# EAGLE design mimic1567 (EAGLE 7.5.0)
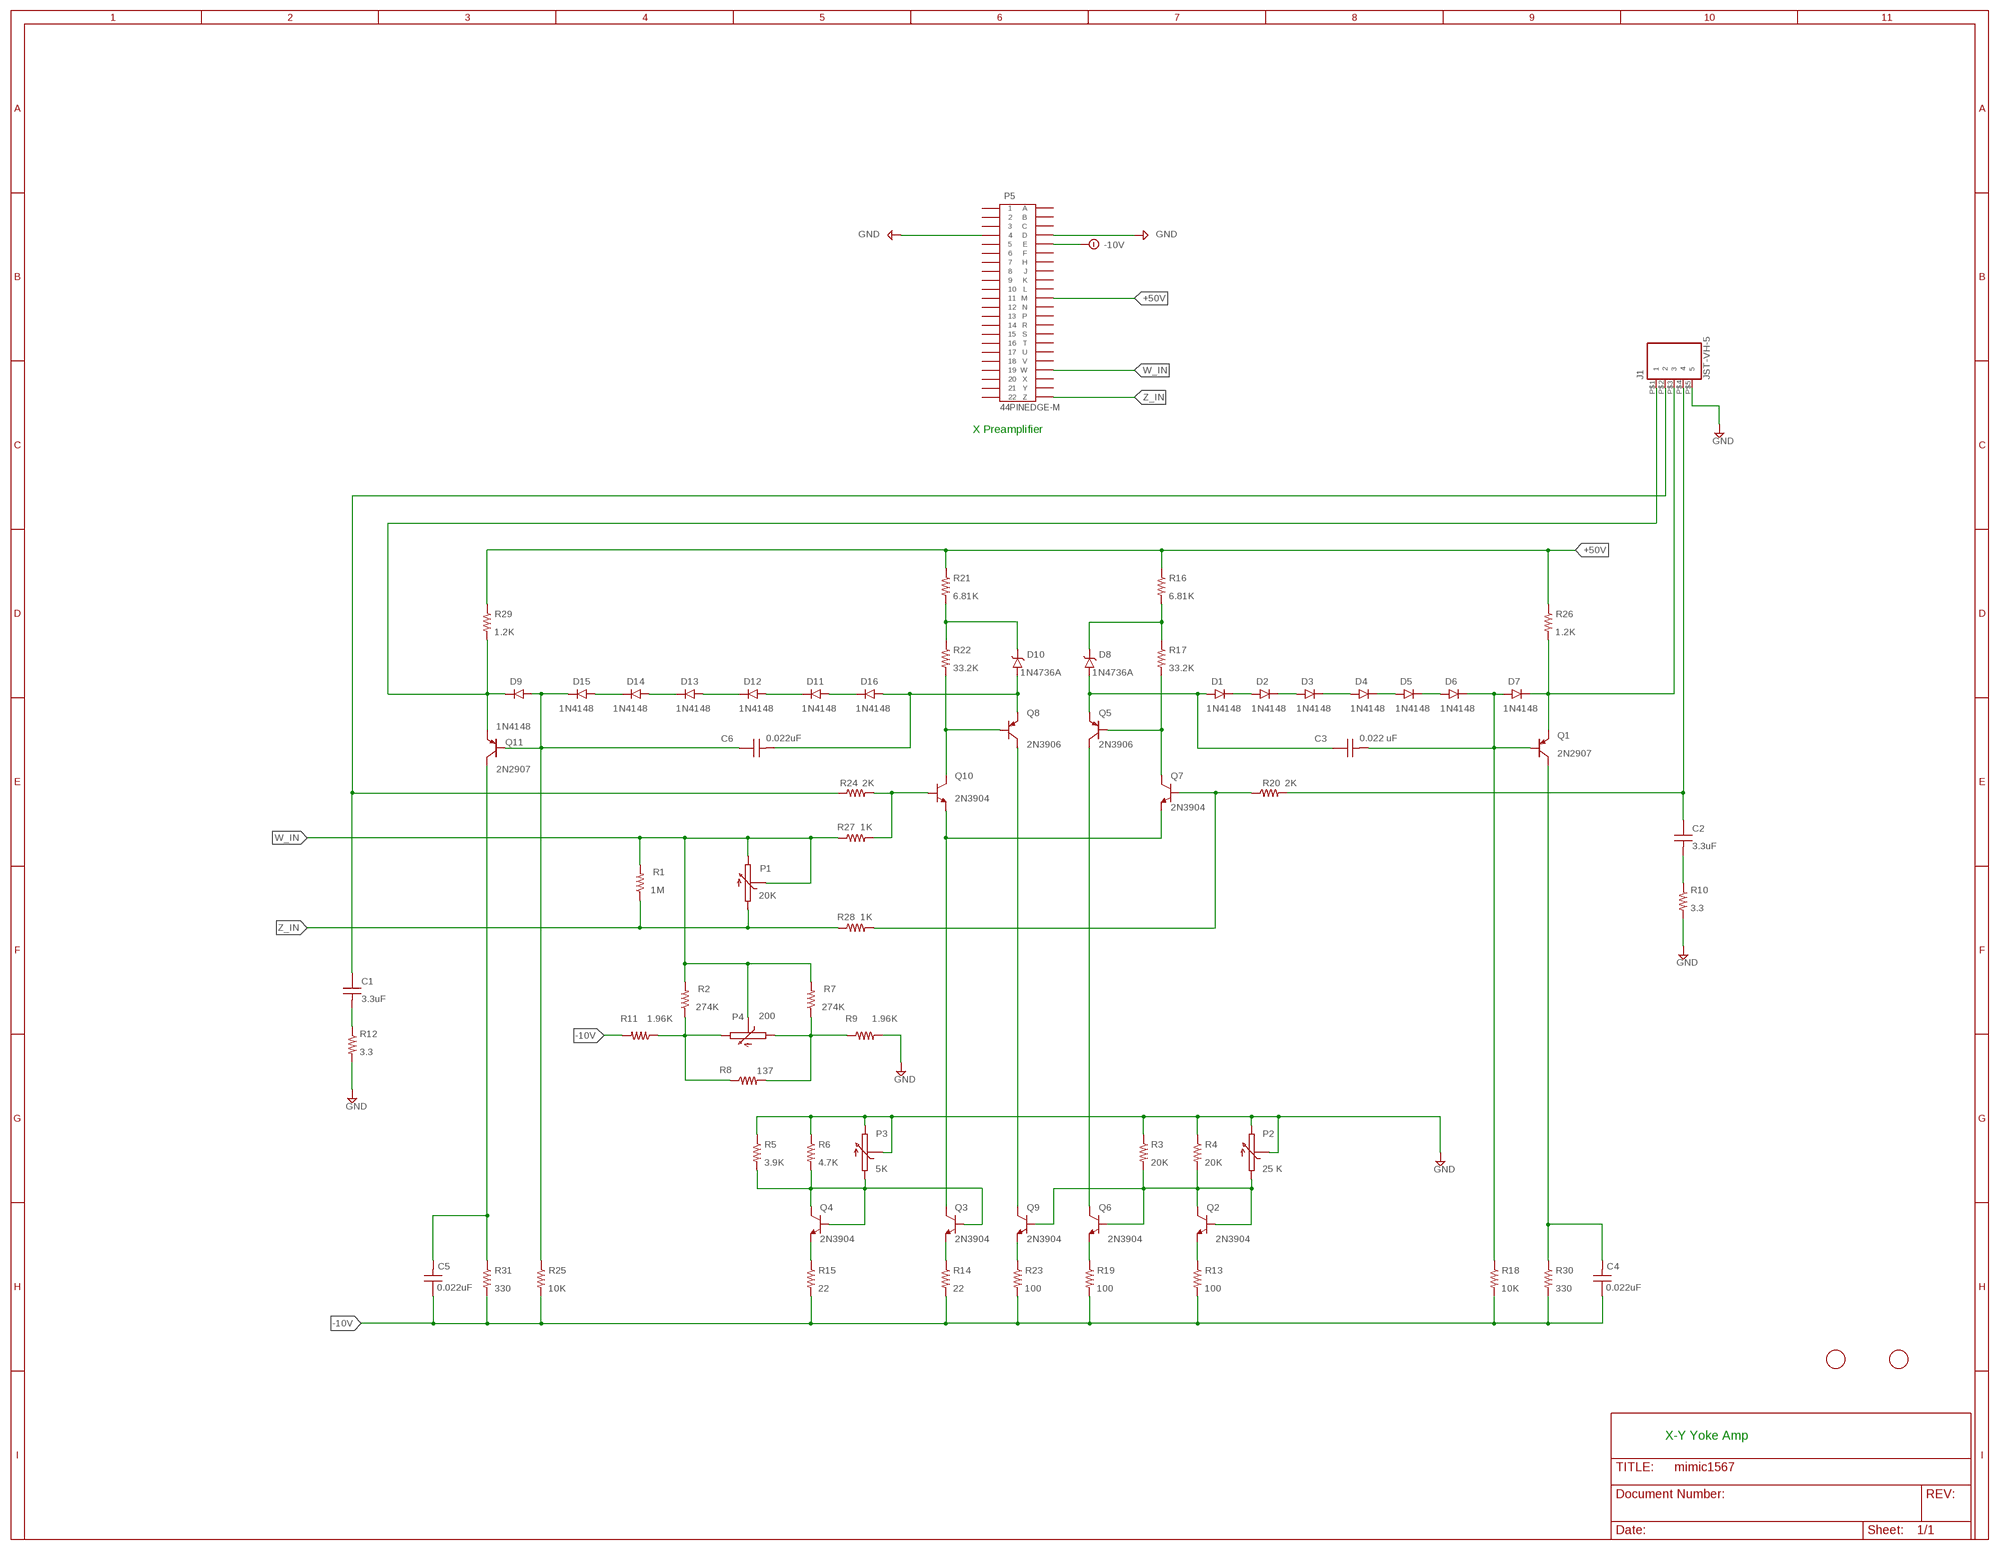
[diagram p0: schematic, sheet 1]

## Parts
C1  3.3uF  ECQ-E2335JF  [CAP-3-PT-ZERO-3UF-250V-FILM]
C2  3.3uF  ECQ-E2335JF  [CAP-3-PT-ZERO-3UF-250V-FILM]
C3  0.022 uF  ECQ-E2223JF  [CAP-ZERO-PT-ZERO-22UF-250V-FILM]
C4  0.022uF  ECQ-E2223JF  [CAP-ZERO-PT-ZERO-22UF-250V-FILM]
C5  0.022uF  ECQ-E2223JF  [CAP-ZERO-PT-ZERO-22UF-250V-FILM]
C6  0.022uF  ECQ-E2223JF  [CAP-ZERO-PT-ZERO-22UF-250V-FILM]
D1  1N4148  [DO35-7]
D2  1N4148  [DO35-7]
D3  1N4148  [DO35-7]
D4  1N4148  [DO35-7]
D5  1N4148  [DO35-7]
D6  1N4148  [DO35-7]
D7  1N4148  [DO35-7]
D8  1N4736A  [DO41]
D9  1N4148  [DO35-7]
D10  1N4736A  [DO41]
D11  1N4148  [DO35-7]
D12  1N4148  [DO35-7]
D13  1N4148  [DO35-7]
D14  1N4148  [DO35-7]
D15  1N4148  [DO35-7]
D16  1N4148  [DO35-7]
J1  JST-VH-5  [VHR-5N]
P1  20K  POT-3006P  [3006P]
P2  25 K  POT-3006P  [3006P]
P3  5K  POT-3006P  [3006P]
P4  200  POT-3006P  [3006P]
P5  44PINEDGE-M  [44PINEDGE]
Q1  2N2907  [TO18]
Q2  2N3904  [TO92]
Q3  2N3904  [TO92]
Q4  2N3904  [TO92]
Q5  2N3906  [TO92]
Q6  2N3904  [TO92]
Q7  2N3904  [TO92]
Q8  2N3906  [TO92]
Q9  2N3904  [TO92]
Q10  2N3904  [TO92]
Q11  2N2907  [TO18]
R1  1M  AXIALRESISTORQUARTER_WATT  [R_QUARTERWATT]
R2  274K  AXIALRESISTORQUARTER_WATT  [R_QUARTERWATT]
R3  20K  AXIALRESISTORQUARTER_WATT  [R_QUARTERWATT]
R4  20K  AXIALRESISTORQUARTER_WATT  [R_QUARTERWATT]
R5  3.9K  AXIALRESISTORQUARTER_WATT  [R_QUARTERWATT]
R6  4.7K  AXIALRESISTORQUARTER_WATT  [R_QUARTERWATT]
R7  274K  AXIALRESISTORQUARTER_WATT  [R_QUARTERWATT]
R8  137  AXIALRESISTORQUARTER_WATT  [R_QUARTERWATT]
R9  1.96K  AXIALRESISTORQUARTER_WATT  [R_QUARTERWATT]
R10  3.3  R-1/2WATT  [0309/12]
R11  1.96K  AXIALRESISTORQUARTER_WATT  [R_QUARTERWATT]
R12  3.3  R-1/2WATT  [0309/12]
R13  100  AXIALRESISTORQUARTER_WATT  [R_QUARTERWATT]
R14  22  AXIALRESISTORQUARTER_WATT  [R_QUARTERWATT]
R15  22  AXIALRESISTORQUARTER_WATT  [R_QUARTERWATT]
R16  6.81K  AXIALRESISTORHALF_WATT  [R_HALFWATT]
R17  33.2K  AXIALRESISTORHALF_WATT  [R_HALFWATT]
R18  10K  AXIALRESISTORHALF_WATT  [R_HALFWATT]
R19  100  AXIALRESISTORQUARTER_WATT  [R_QUARTERWATT]
R20  2K  AXIALRESISTORQUARTER_WATT  [R_QUARTERWATT]
R21  6.81K  AXIALRESISTORHALF_WATT  [R_HALFWATT]
R22  33.2K  AXIALRESISTORHALF_WATT  [R_HALFWATT]
R23  100  AXIALRESISTORQUARTER_WATT  [R_QUARTERWATT]
R24  2K  AXIALRESISTORQUARTER_WATT  [R_QUARTERWATT]
R25  10K  AXIALRESISTORHALF_WATT  [R_HALFWATT]
R26  1.2K  R-5WATT  [R_FIVEWATT]
R27  1K  AXIALRESISTORQUARTER_WATT  [R_QUARTERWATT]
R28  1K  AXIALRESISTORQUARTER_WATT  [R_QUARTERWATT]
R29  1.2K  R-5WATT  [R_FIVEWATT]
R30  330  AXIALRESISTORONE_WATT  [R_ONEWATT]
R31  330  AXIALRESISTORONE_WATT  [R_ONEWATT]
U$1  FIDUCIAL  [FIDUCIAL_1MM]
U$2  FIDUCIAL  [FIDUCIAL_1MM]

## Nets
+50V: P5.M R16.1 R21.1 R26.1 R29.1
-10V: C4.1 C5.1 P5.E R11.2 R13.2 R14.2 R15.2 R18.2 R19.2 R23.2 R25.2 R30.2 R31.2
GND: J1.P$5 P2.2 P2.3 P3.2 P3.3 P5.4 P5.D R3.1 R4.1 R5.1 R6.1 R9.2 R10.2 R12.2
N$1: Q4.1(E) R15.1
N$2: C2.1 J1.P$4 R20.2
N$3: C2.2 R10.1
N$4: P2.1 Q2.2(B) Q2.3(C) Q6.2(B) Q9.2(B) R3.2 R4.2
N$5: D7.C J1.P$3 Q1.1(E) R26.2
N$6: Q7.2(B) R20.1 R28.2
N$7: C3.2 D6.C D7.A Q1.2(B) R18.1
N$8: C4.2 Q1.3(C) R30.1
N$9: Q8.1(C) Q9.3(C)
N$10: D5.C D6.A
N$11: D4.C D5.A
N$12: D3.C D4.A
N$13: D2.C D3.A
N$14: D1.C D2.A
N$15: C3.1 D1.A D8.A Q5.3(E)
N$16: Q5.2(B) Q7.3(C) R17.2
N$17: D8.C R16.2 R17.1
N$18: Q3.1(E) R14.1
N$19: Q3.3(C) Q7.1(E) Q10.1(E)
N$20: D10.C R21.2 R22.1
N$21: Q5.1(C) Q6.3(C)
N$22: P4.1 R7.1 R8.2 R9.1
N$23: Q9.1(E) R23.1
N$24: Q6.1(E) R19.1
N$25: Q8.2(B) Q10.3(C) R22.2
N$26: Q2.1(E) R13.1
N$27: C1.1 J1.P$2 R24.1
N$29: P3.1 Q3.2(B) Q4.2(B) Q4.3(C) R5.2 R6.2
N$30: C1.2 R12.1
N$31: D9.C J1.P$1 Q11.1(E) R29.2
N$33: C6.1 D9.A D15.C Q11.2(B) R25.1
N$34: C5.2 Q11.3(C) R31.1
N$35: D14.C D15.A
N$36: D13.C D14.A
N$37: D12.C D13.A
N$38: D11.C D12.A
N$39: D11.A D16.C
N$40: C6.2 D10.A D16.A Q8.3(E)
N$43: Q10.2(B) R24.2 R27.2
N$44: P4.3 R2.1 R8.1 R11.1
W_IN: P1.2 P1.3 P4.2 P5.W R1.2 R2.2 R7.2 R27.1
Z_IN: P1.1 P5.Z R1.1 R28.1
Unconnected: P5.1 P5.2 P5.3 P5.5 P5.6 P5.7 P5.8 P5.9 P5.10 P5.11 P5.12 P5.13 P5.14 P5.15 P5.16 P5.17 P5.18 P5.19 P5.20 P5.21 P5.22 P5.A P5.B P5.C P5.F P5.H P5.J P5.K P5.L P5.N P5.P P5.R P5.S P5.T P5.U P5.V P5.X P5.Y

## Notes on the sheet
- X Preamplifier
- X-Y Yoke Amp

## Library data of the parts
C1 C2 = keiths:ECQ-E2335JF: FILM CAPACITOR, 3.3UF, 250V, 5%, RADIAL Capacitor Dielectric Type:PET (Polyester) Metallized Polyester Film Capacitor; PN: ECQ-E2335JF
C3-C6 = keiths:ECQ-E2223JF: FILM CAPACITOR, 0.022UF, 250V, 5%, RADIAL Capacitor Dielectric Type:PET (Polyester) Lead Spacing:10mm; PN: ECQ-E2223JFB
D1-D7 D9 D11-D16 = keiths:1N4148: High Conductance Fast Diode; PN: 1N4148
D8 D10 = keiths:1N4736A: Z DIODE 6.8 V, 1W, 5 percent; PN: 1N4736A
J1 = keiths:JST-VH-5: JST CONN HEADER VH SIDE 5POS 3.96MM
P1 = keiths:POT-3006P: 3006 - Trimpot® Trimming Potentiometer. Clockwise turn moves wiper to pin 3; PN: 3006P-1-203LF
P2 = keiths:POT-3006P: 3006 - Trimpot® Trimming Potentiometer. Clockwise turn moves wiper to pin 3; PN: 3006P-1-253LF
P3 = keiths:POT-3006P: 3006 - Trimpot® Trimming Potentiometer. Clockwise turn moves wiper to pin 3; PN: 3006P-1-103LF
P4 = keiths:POT-3006P: 3006 - Trimpot® Trimming Potentiometer. Clockwise turn moves wiper to pin 3; PN: 3006P-1-201LF
P5 = keiths:44PINEDGE-M: 44 PIN EDGE CONNECTOR FOR PCB
Q1 Q11 = keiths:2N2907: The 2N2907 is a commonly available PNP bipolar junction transistor used for general purpose low-power amplifying or switching applications. It is designed for low to medium current, low power, medium voltage, and can operate at moderately high speeds.; PN: 2N2907A
Q2-Q4 Q6 Q7 Q9 Q10 = keiths:2N3904: NPN Transistor; PN: 2N3904
Q5 Q8 = keiths:2N3906: PNP Transistor; PN: 2N3906
R1 R2 R7 = keiths:AXIALRESISTOR: Through hole axial leaded resistors.; PN: MFR-25FBF52-274K
R3 R5 R13-R15 R19 R23 = keiths:AXIALRESISTOR: Through hole axial leaded resistors.; PN: RNF14FTD2K94
R4 R6 = keiths:AXIALRESISTOR: Through hole axial leaded resistors.; PN: RNF14FTD4K64
R8 = keiths:AXIALRESISTOR: Through hole axial leaded resistors.; PN: CMF55137R00FHEB
R9 R11 = keiths:AXIALRESISTOR: Through hole axial leaded resistors.; PN: RNF14FTD1K96
R10 R12 = keiths:R-1/2WATT: Half watt through hole resistor.
R16 R21 = keiths:AXIALRESISTOR: Through hole axial leaded resistors.; PN: MFS1/2DCT52R6811F
R17 R22 = keiths:AXIALRESISTOR: Through hole axial leaded resistors.; PN: SFR16S0003322FR500
R18 R25 = keiths:AXIALRESISTOR: Through hole axial leaded resistors.; PN: MF1/2LCT52R103J
R20 R24 = keiths:AXIALRESISTOR: Through hole axial leaded resistors.; PN: MFR-25FRF52-2K
R26 R29 = keiths:R-5WATT: Cemented Leaded Wirewound Resistors; PN: AC05000001201JAC00
R27 R28 = keiths:AXIALRESISTOR: Through hole axial leaded resistors.; PN: MFR-25FRF52-1K
R30 R31 = keiths:AXIALRESISTOR: Through hole axial leaded resistors.; PN: SFR16S0003300JA500
U$1 U$2 = adafruit:FIDUCIAL: For use by pick and place machines to calibrate the vision/machine, 1mm By microbuilder.eu

## Board
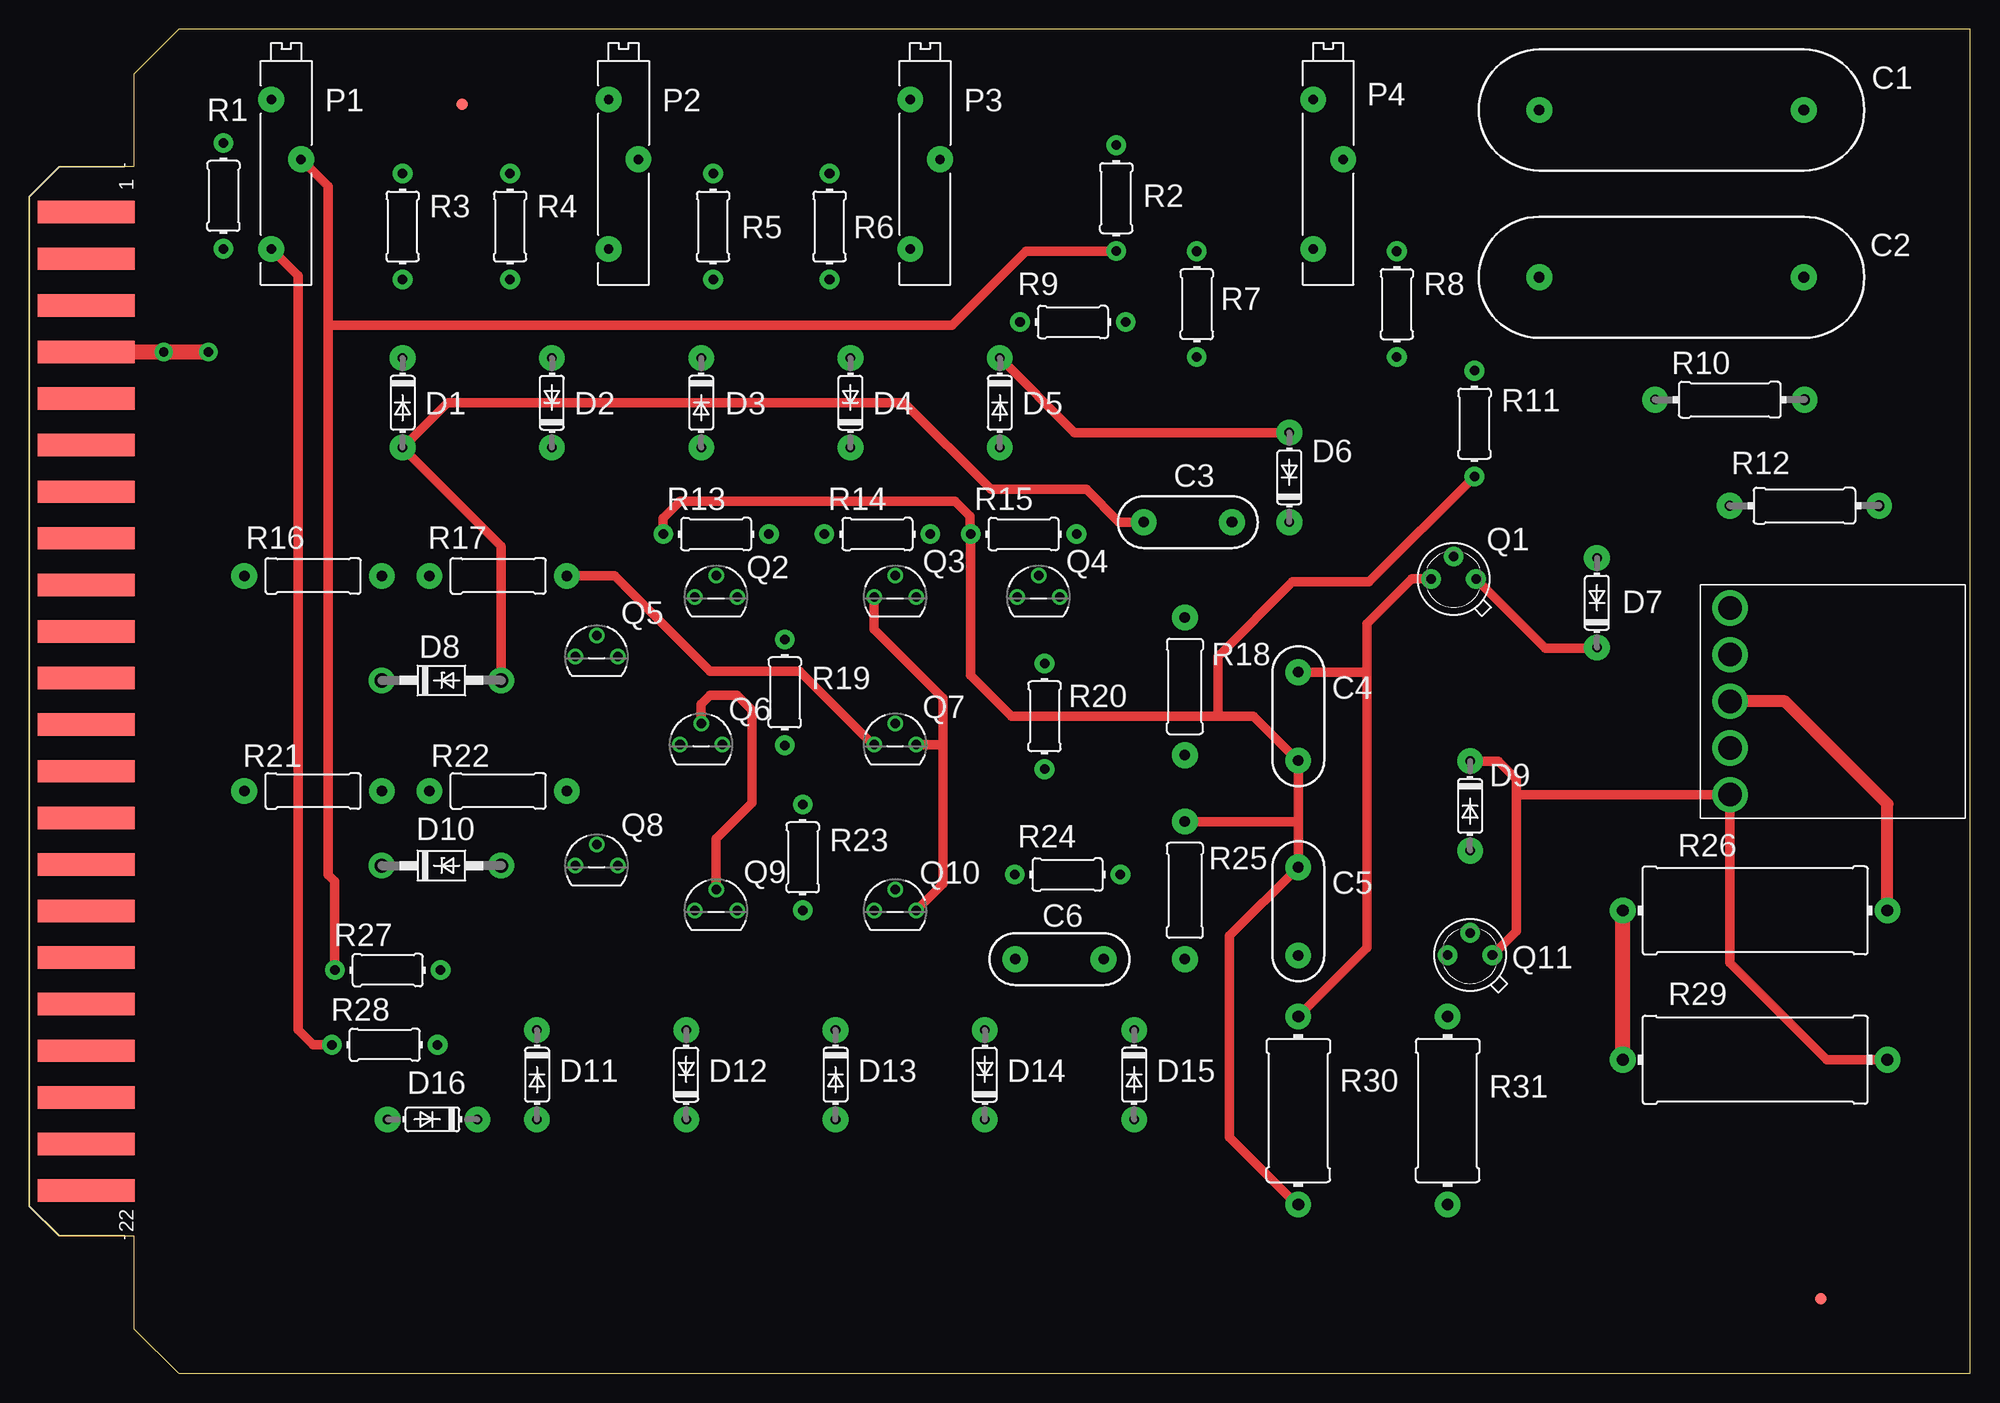
[diagram p1: board, top side]
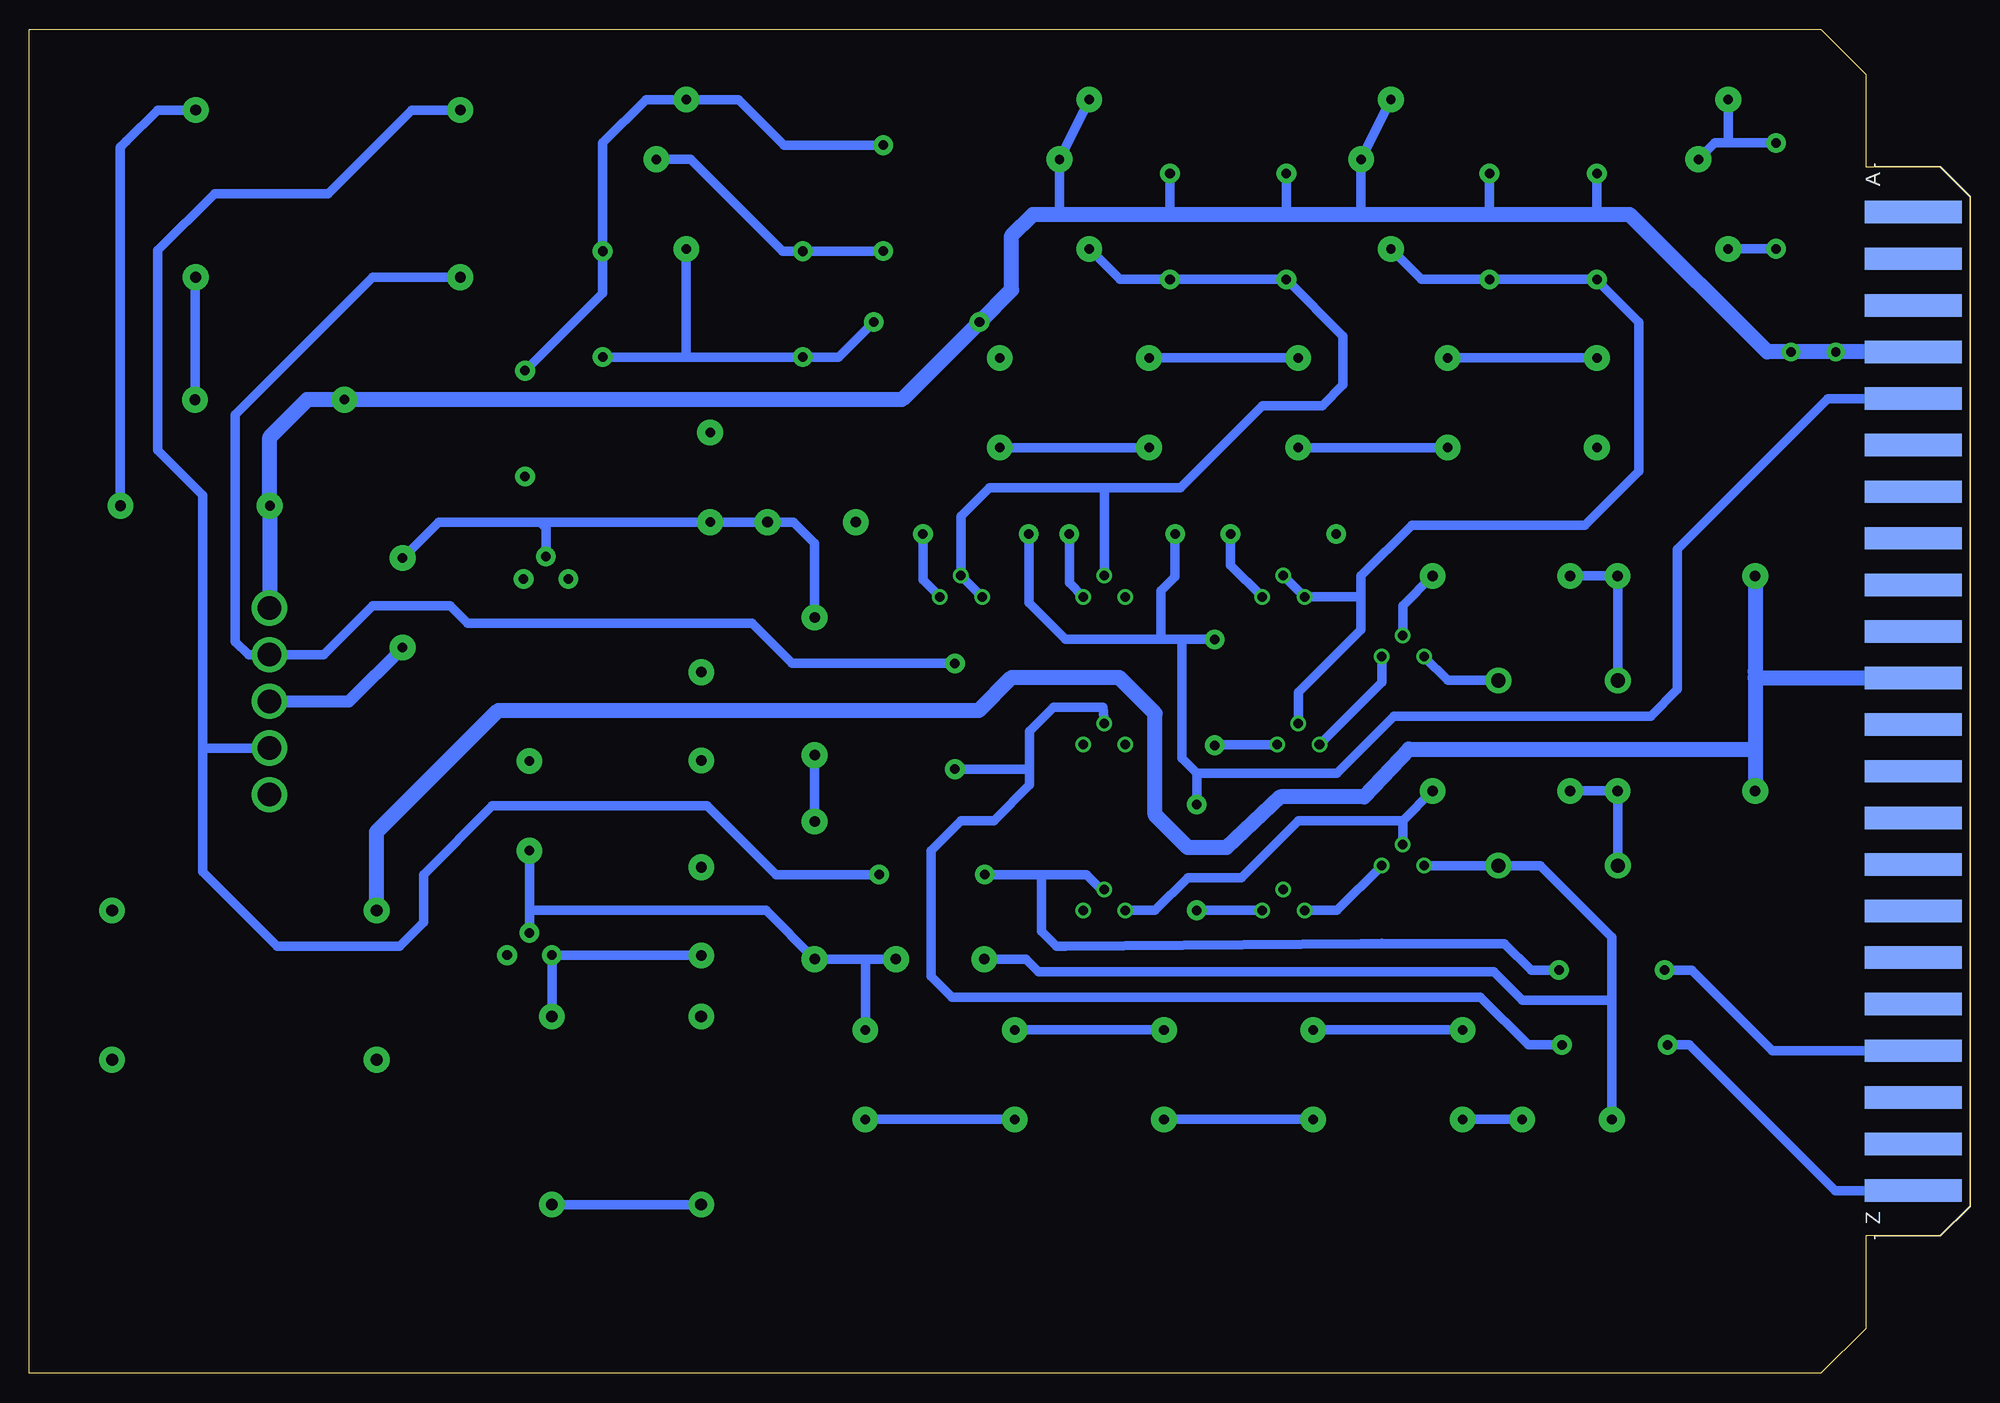
[diagram p2: board, bottom side, seen from below]

Size 165.1 x 114.3 mm. Coordinates in mm from the lower left corner, seen from the top.
Outline: 2.54,11.68 8.89,11.68 8.89,3.81 12.7,0 165.1,0 165.1,114.3 12.7,114.3 8.89,110.49 8.89,102.62 2.54,102.62 0,100.08 0,14.22 2.54,11.68
Copper layers (1*16): Top 0.035mm / dielectric 1.5mm / Bottom 0.035mm
Design rules "throughhole *": minimum track width 32mil, minimum drill 26mil, track to track 30mil, track to pad 30mil, pad to pad 30mil, via to via 30mil, smd to smd 30mil, copper to edge 20mil, drill to drill 20mil, minimum pad ring 10mil, minimum via ring 15mil, stop-mask expansion 4mil, vias tented up to drill 0mil, thermal gap 10mil

### Footprints (pad centres in the part's own frame; a part is rotated, then mirrored left to right if it is on the bottom)
CAP-3-PT-ZERO-3UF-250V-FILM = drill 0.9 pad 2.184: 1 -11.25,0; 2 11.25,0
CAP-ZERO-PT-ZERO-22UF-250V-FILM = drill 0.9 pad 2.184: 1 -3.75,0; 2 3.75,0
DO35-7 = drill 0.813 pad 2.184: A 3.81,0; C -3.81,0
DO41 = drill 1.2 pad 2.184: A 5.08,0; C -5.08,0
VHR-5N = drill 2: P$1 -9,-7.938; P$2 -9,-3.969; P$3 -9,0; P$4 -9,3.969; P$5 -9,7.938
3006P = drill 0.8 pad 2.184: 1 -6.477,1.27; 2 1.143,-1.27; 3 6.223,1.27
44PINEDGE = smd 1.905 x 8.255: 1 -41.605,4.826; 2 -37.643,4.826; 3 -33.68,4.826; 4 -29.718,4.826; 5 -25.756,4.826; 6 -21.793,4.826; 7 -17.831,4.826; 8 -13.868,4.826; 9 -9.906,4.826; 10 -5.944,4.826; 11 -1.981,4.826; 12 1.981,4.826; 13 5.944,4.826; 14 9.906,4.826; 15 13.868,4.826; 16 17.831,4.826; 17 21.793,4.826; 18 25.756,4.826; 19 29.718,4.826; 20 33.68,4.826; 21 37.643,4.826; 22 41.605,4.826 | smd 1.905 x 8.255 bottom: A -41.605,4.826; B -37.643,4.826; C -33.68,4.826; D -29.718,4.826; E -25.756,4.826; F -21.793,4.826; H -17.831,4.826; J -13.868,4.826; K -9.906,4.826; L -5.944,4.826; M -1.981,4.826; N 1.981,4.826; P 5.944,4.826; R 9.906,4.826; S 13.868,4.826; T 17.831,4.826; U 21.793,4.826; V 25.756,4.826; W 29.718,4.826; X 33.68,4.826; Y 37.643,4.826; Z 41.605,4.826
TO18 = drill 0.813 pad 1.676: 1 1.905,0; 2 0,1.905; 3 -1.905,0
TO92 = drill 0.813: 1 1.27,-1.27; 2 1.27,1.27; 3 -1.27,1.27
R_QUARTERWATT = drill 0.813 pad 1.676: 1 -4.5,0; 2 4.5,0
0309/12 = drill 0.9 pad 2.184: 1 -6.35,0 | drill 0.813 pad 2.184: 2 6.35,0
R_HALFWATT = drill 0.9 pad 2.184: 1 -5.85,0; 2 5.85,0
R_FIVEWATT = drill 1 pad 2.184: 1 -11.25,0; 2 11.25,0
R_ONEWATT = drill 1 pad 2.184: 1 -8,0; 2 8,0
FIDUCIAL_1MM = smd 1 x 1: 1 0,0

### Placement (x,y rotation side)
C1  139.7,107.44 0 top
C2  139.7,93.22 0 top
C3  98.55,72.39 0 top
C4  107.95,55.88 90 top
C5  107.95,39.29 270 top
C6  87.63,35.22 180 top
D1  31.75,82.55 270 top
D2  44.45,82.55 90 top
D3  57.15,82.55 270 top
D4  69.85,82.55 90 top
D5  82.55,82.55 270 top
D6  107.19,76.2 90 top
D7  133.35,65.53 90 top
D8  35.05,58.93 0 top
D9  122.56,48.26 270 top
D10  35.05,43.18 0 top
D11  43.18,25.4 270 top
D12  55.88,25.4 90 top
D13  68.58,25.4 270 top
D14  81.28,25.4 90 top
D15  93.98,25.4 270 top
D16  34.29,21.59 180 top
J1  153.67,57.15 0 top
P1  21.84,102.11 90 top
P2  50.55,102.11 90 top
P3  76.2,102.11 90 top
P4  110.49,102.11 90 top
P5  0,57.15 270 top
Q1  121.16,67.56 0 top
Q2  58.42,66.04 45 top
Q3  73.66,66.04 45 top
Q4  85.85,66.04 45 top
Q5  48.26,60.96 45 top
Q6  57.15,53.47 45 top
Q7  73.66,53.47 45 top
Q8  48.26,43.18 45 top
Q9  58.42,39.37 45 top
Q10  73.66,39.37 45 top
Q11  122.56,35.56 0 top
R1  16.51,100.14 90 top
R2  92.46,99.95 270 top
R3  31.75,97.54 270 top
R4  40.89,97.54 270 top
R5  58.17,97.54 270 top
R6  68.07,97.54 270 top
R7  99.31,90.93 90 top
R8  116.33,90.93 270 top
R9  88.77,89.41 180 top
R10  144.65,82.8 180 top
R11  122.94,80.77 270 top
R12  151,73.79 180 top
R13  58.42,71.37 180 top
R14  72.14,71.37 180 top
R15  84.58,71.37 180 top
R16  24.13,67.82 0 top
R17  39.88,67.82 0 top
R18  98.3,58.42 270 top
R19  64.26,57.91 90 top
R20  86.36,55.88 90 top
R21  24.13,49.53 0 top
R22  39.88,49.53 0 top
R23  65.79,43.88 90 top
R24  88.32,42.42 180 top
R25  98.3,41.07 90 top
R26  146.81,39.37 0 top
R27  30.48,34.29 0 top
R28  30.23,27.94 0 top
R29  146.81,26.67 0 top
R30  107.95,22.35 270 top
R31  120.65,22.35 270 top
U$1  36.83,107.95 0 top
U$2  152.4,6.35 0 top

### Tracks (layer width: path | path; a pad name or v marks a point on that pad's centre or on a via)
+50V
  Top 1.27: R29.1 R26.1
  Bottom 0.813: 18.53,53.09 18.28,52.83 | 18.28,59.13 18.28,59.69
  Bottom 1.016: 18.28,59.69 18.28,59.18 18.23,59.13
  Bottom 1.27: R16.1 18.28,59.69 | 18.28,59.18 18.28,52.83 R21.1 | 18.53,53.09 47.75,53.09 51.56,49.02 58.67,49.02 63.25,44.7 66.55,44.7 69.34,47.5 69.34,56.13 72.39,59.18 81.53,59.18 84.33,56.39 125.22,56.39 135.56,46.05 R26.1 | P5.M 18.28,59.13
-10V
  Top 0.813: R30.2 107.82,14.35 102.11,20.07 102.11,37.2 C5.1 107.95,46.92 | 107.95,46.92 C4.1 107.89,52.13 104.14,55.88 101.09,55.88 | R25.2 107.95,46.92 | R13.2 53.92,72.72 55.37,74.17 78.74,74.17 80.01,72.9 80.01,71.45 R15.2 80.08,59.36 83.57,55.88 101.09,55.88 | 101.09,55.88 101.09,60.96 107.44,67.31 113.97,67.31 R11.2
  Bottom 0.813: R31.2 R30.2 | R18.2 R25.2 | R15.2 80.08,65.53 76.96,62.41 68.83,62.41 68.83,62.48 | 65.79,51.05 53.85,51.05 49.02,55.88 27.18,55.88 24.89,58.17 24.89,70.1 12.09,82.91 P5.E | R14.2 67.64,67.75 68.83,66.55 68.83,62.48 | R23.2 65.79,51.05 | R19.2 67.06,62.41 | 67.06,62.41 68.76,62.41 68.83,62.48 | 65.79,51.05 67.06,52.32 67.06,62.41
GND  (via drill 0.8)
  Top 1.27: P5.4 v11.43,86.87 v15.24,86.87
  Bottom 0.813: R3.1 31.75,98.55 | R4.1 40.89,98.55 | 51.82,98.55 P2.2 P2.3 | R5.1 58.17,98.55 | R6.1 68.07,98.55 | 77.47,98.55 P3.2 P3.3 | R10.2 96.01,82.8 | R12.2 144.67,73.77
  Bottom 1.27: 144.67,73.77 J1.P$5 | R12.2 144.65,79.63 141.48,82.8 R10.2 90.88,82.8 R9.2 81.53,92.15 81.53,96.77 79.76,98.55 77.47,98.55 68.07,98.55 58.17,98.55 51.82,98.55 40.89,98.55 31.75,98.55 28.96,98.55 17.27,86.87 v15.24,86.87 v11.43,86.87 P5.4
N$1
  Bottom 0.813: R15.1 89.08,69.6 89.08,68.74 89.08,67.47 Q4.1
N$2
  Bottom 0.813: R20.2 100.22,60.38 103.63,63.79 127.8,63.79 129.29,65.28 135.89,65.28 140.05,61.12 J1.P$4 146.46,61.12 147.57,62.23 147.57,81.53 135.89,93.22 C2.1
N$3
  Bottom 0.813: R10.1 151,93.17 C2.2
N$4
  Top 0.813: Q9.2 58.42,45.47 61.47,48.51 61.47,56.39 60.2,57.66 57.91,57.66 57.15,56.9 Q6.2
  Bottom 0.813: P2.1 46.68,93.04 R4.2 R3.2 31.75,92.96 28.19,89.41 28.19,76.71 32.77,72.14 47.5,72.14 51.82,67.82 51.82,66.04 | Q2.2 Q2.3 51.82,66.04 | Q6.2 57.15,57.91 51.82,63.25 51.82,66.04
N$5
  Top 0.813: Q1.1 128.97,61.66 133.29,61.66 D7.C
  Top 1.016: R26.2 158.06,48.44 149.35,57.15 J1.P$3
  Bottom 1.016: J1.P$3 137.92,57.15 D7.C
N$6
  Bottom 0.813: Q7.2 73.77,56.64 77.98,56.64 80.01,54.61 80.01,51.56 | R20.1 80.19,51.38 80.01,51.56 | 80.01,51.56 80.01,50.04 83.06,46.99 85.85,46.99 88.39,44.45 88.39,33.78 86.61,32 41.66,32 37.59,27.94 R28.2
N$7
  Bottom 0.813: D7.A 130.3,72.39 121.67,72.39 | 121.67,72.39 D6.C C3.2 100.08,72.39 98.3,70.61 R18.1 | Q1.2 121.16,71.88 121.67,72.39
N$8
  Top 0.813: R30.1 113.79,36.19 113.79,59.63 | 113.79,59.63 113.79,63.75 117.6,67.56 Q1.3 | C4.2 113.79,59.63
N$9
  Bottom 0.813: Q8.1 53.87,39.37 Q9.3
N$10
  Top 0.813: D6.A 88.9,80.01 D5.C
N$11
  Bottom 0.813: D5.A D4.C
N$12
  Bottom 0.813: D3.C D4.A
N$13
  Bottom 0.813: D2.C D3.A
N$14
  Bottom 0.813: D1.C D2.A
N$15
  Top 0.813: C3.1 92.71,72.39 89.92,75.18 81.79,75.18 74.42,82.55 35.56,82.55 D1.A 40.13,70.36 D8.A
  Bottom 0.813: D8.A 44.43,58.93 Q5.3
N$16
  Top 0.813: Q7.3 71.75,53.47 65.53,59.69 57.91,59.69 49.78,67.82 R17.2
  Bottom 0.813: Q5.2 48.26,65.29 R17.2
N$17
  Bottom 0.813: R17.1 R16.2 D8.C
N$18
  Bottom 0.813: R14.1 76.64,67.22 Q3.1
N$19
  Top 0.813: 77.72,53.59 77.72,41.64 Q10.1 | Q3.3 71.86,63.26 77.72,57.4 77.72,53.59 | Q7.1 77.6,53.47 77.72,53.59
N$20
  Bottom 0.813: R22.1 R21.2 D10.C
N$21
  Bottom 0.813: Q6.3 50.06,58.77 Q5.1
N$22
  Bottom 0.813: R8.2 109.22,86.43 | 109.22,86.43 R7.1 96.25,86.43 R9.1 | P4.1 109.22,86.43
N$23
  Bottom 0.813: Q9.1 R23.1
N$24
  Bottom 0.813: Q6.1 64.21,53.47 R19.1
N$25
  Bottom 0.813: Q10.3 69.34,39.37 66.55,42.16 61.98,42.16 57.14,47 48.26,47 | 48.26,47 R22.2 | Q8.2 48.26,47
N$26
  Bottom 0.813: Q2.1 62.92,68.74 R13.1
N$27
  Bottom 0.813: 150.37,53.34 150.37,74.68 154.18,78.49 154.18,95.5 149.35,100.33 139.7,100.33 132.59,107.44 C1.1 | 150.37,53.34 150.37,42.67 144.02,36.32 133.6,36.32 131.57,38.35 131.57,42.42 125.73,48.26 107.44,48.26 101.6,42.42 R24.1 | J1.P$2 150.21,53.18 150.37,53.34
N$29
  Bottom 0.813: P3.1 72.33,93.04 R6.2 R5.2 53.34,88.21 53.34,84.07 55.12,82.3 60.2,82.3 67.18,75.31 73.66,75.31 | 73.66,75.31 83.44,75.31 85.85,72.9 Q4.2 | Q3.2 73.66,75.31 | Q4.3 Q4.2 | Q4.2
N$30
  Bottom 0.813: R12.1 157.35,104.27 157.23,104.39 156.84,104.78 154.18,107.44 C1.2
N$31
  Top 0.813: Q11.1 126.49,37.59 126.49,49.28 | 126.49,49.28 126.49,50.55 124.97,52.07 D9.C | R29.2 152.91,26.67 144.67,34.91 J1.P$1 126.56,49.21 126.49,49.28
N$33
  Bottom 0.813: D9.A 122.56,39.37 | 122.56,39.37 Q11.2 | 122.56,39.37 102.45,39.37 R25.1 93.98,35.22 | 93.98,35.22 C6.1 | D15.C 93.98,35.22
N$34
  Bottom 0.813: R31.1 Q11.3 107.97,35.56 C5.2
N$35
  Bottom 0.813: D14.C D15.A
N$36
  Bottom 0.813: D14.A D13.C
N$37
  Bottom 0.813: D12.C D13.A
N$38
  Bottom 0.813: D11.C D12.A
N$39
  Bottom 0.813: D16.C D11.A
N$40
  Bottom 0.813: Q8.3 D10.A 36.58,43.18 30.48,37.08 30.48,31.75 | C6.2 80.31,35.22 79.25,34.16 40.51,34.16 38.1,31.75 30.48,31.75 | D16.A 30.48,31.75
N$43
  Bottom 0.813: 51.82,36.55 76.96,36.32 77.72,36.32 78.99,37.59 78.99,42.42 | 51.82,36.55 50.04,36.57 50.04,36.58 | 78.99,42.42 75.18,42.42 73.93,41.17 Q10.2 | 78.99,42.42 R24.2 | R27.2 37.34,34.29 39.6,36.55 51.82,36.55
N$44
  Bottom 0.813: R11.1 116.33,91.88 R8.1 116.33,104.65 112.65,108.33 P4.3 104.78,108.33 100.89,104.45 R2.1
W_IN
  Top 0.813: 25.4,89.15 25.4,42.42 25.98,41.84 R27.1 | 25.4,89.15 25.4,100.97 P1.2 | 25.4,89.15 78.49,89.15 84.76,95.43 92.44,95.43 R2.2
  Bottom 0.813: R1.2 20.57,104.64 | 20.57,104.64 21.73,104.64 P1.2 | P1.3 20.57,104.64 | P4.2 108.84,103.25 101.02,95.43 R7.2 92.47,95.43 R2.2 | R27.1 23.69,34.29 16.84,27.43 P5.W
Z_IN
  Top 0.813: P1.1 22.86,93.34 22.86,29.21 24.13,27.94 R28.1
  Bottom 0.813: P1.1 R1.1 | R28.1 23.88,27.94 11.48,15.54 P5.Z

### Text on the board
logo: board type 1567 / preamplifier